# Altium schematic sheet [09]-USB,IMU,GNSS.SchDoc: S32K1_CONTROLLER
size A3; Date: 2/13/2019 7:04:58 PM; SheetNumber: 09; SheetTotal: 11; GateName_1: G$1; SymbolName_1: FRAME_B_L; LibraryName: frames; DeviceSetName: FRAME_B_L; GateName_2: G$2; SymbolName_2: DOCFIELD
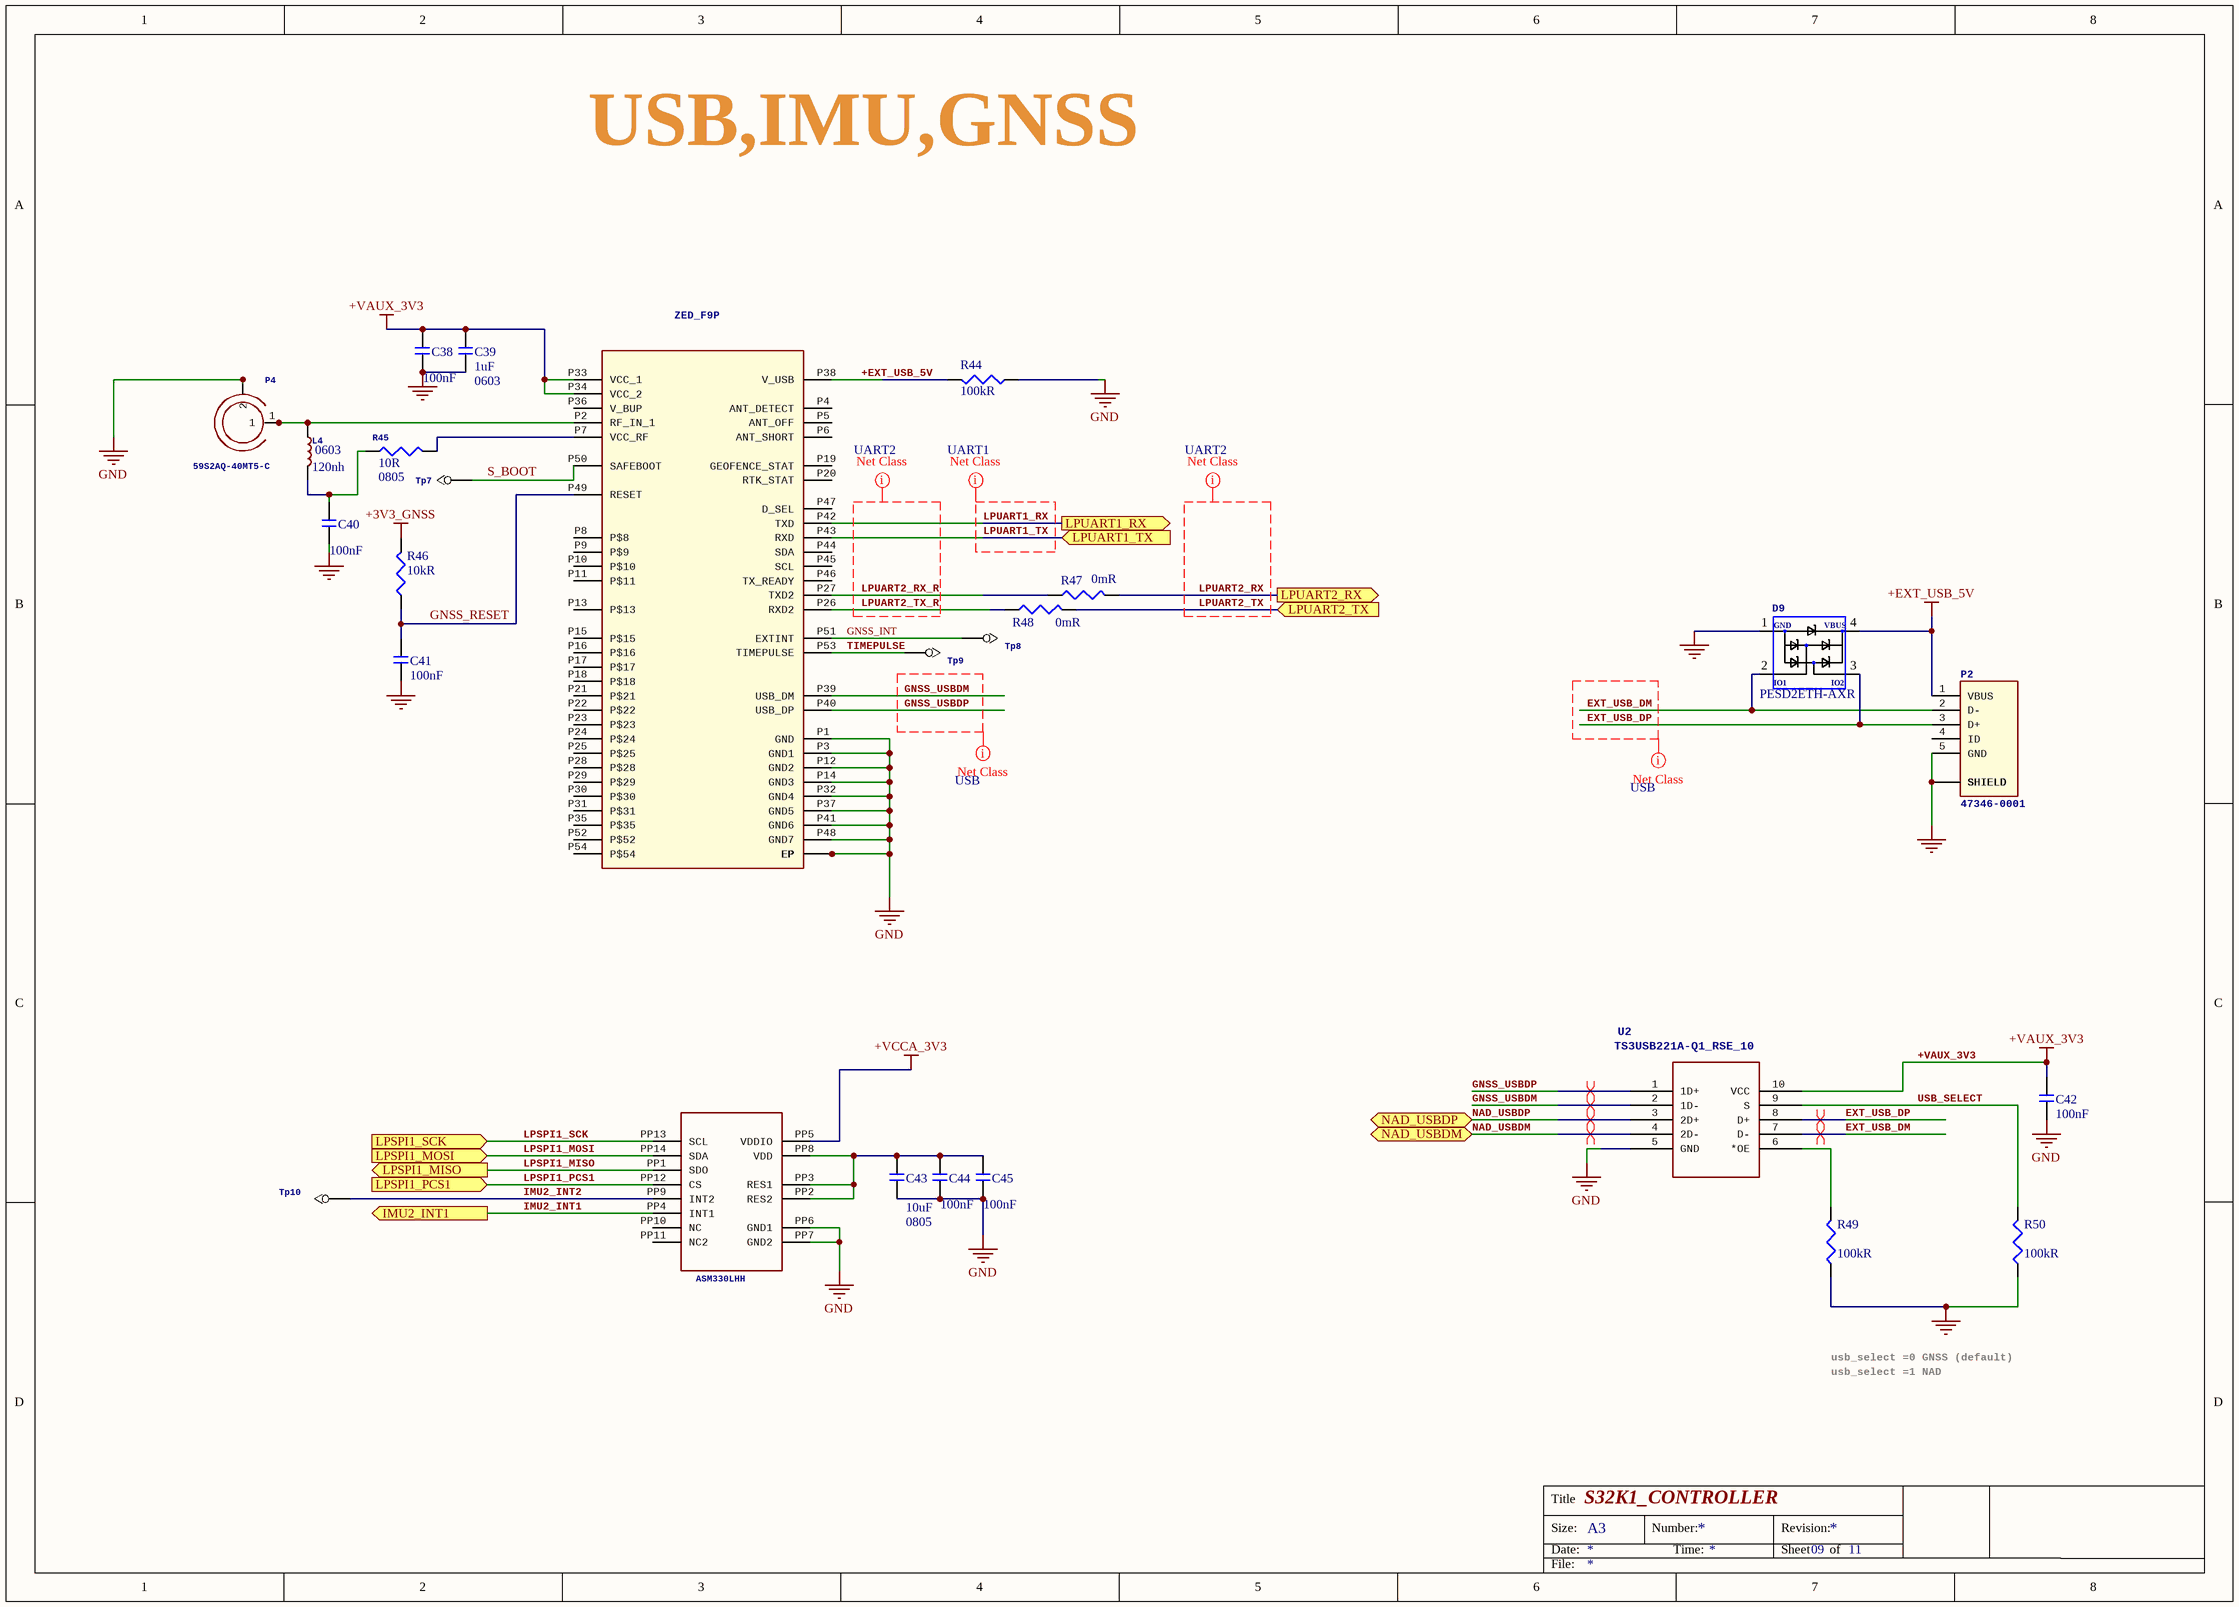
[diagram p0: [09]-USB,IMU,GNSS.SchDoc]

## Parts
C38  Capacitance: 100nF  [CAP0402]  (hidden comment: GCM155R71C104KA55D)
C39  Capacitance: 1uF  Case/Package: 0603  [CAP0603]  (hidden comment: CGA3E1X7R1C105K080AC)
C40  Capacitance: 100nF  [CAP0402]  (hidden comment: GCM155R71C104KA55D)
C41  Capacitance: 100nF  [CAP0402]  (hidden comment: GCM155R71C104KA55D)
C42  Capacitance: 100nF  [CAP0402]  (hidden comment: GCM155R71C104KA55D)
C43  Capacitance: 10uF  Case/Package: 0805  [CAP0805]  (hidden comment: CGA4J1X5R1C106K125AC)
C44  Capacitance: 100nF  [CAP0402]  (hidden comment: GCM155R71C104KA55D)
C45  Capacitance: 100nF  [CAP0402]  (hidden comment: GCM155R71C104KA55D)
D9  PESD2ETH-AXR  [WEON_SOT192P238X100-4N]
L4  Case/Package: 0603  Inductance: 120nh  [RES0603]  (hidden comment: LQW18ANR12J00D)
P2  47346-0001  [MOLEX_47346-0001]
P4  59S2AQ-40MT5-C  [59S2AQ-40MT5-C]
R44  Resistance: 100kR  [RES0402]  (hidden comment: ERJ-2GEJ104X)
R45  Resistance: 10R  Case Code (Imperial): 0805  [RES0805]  (hidden comment: ERJ-6ENF10R0V)
R46  Resistance: 10kR  [RES0402]  (hidden comment: ERJ-2GEJ103X)
R47  Resistance: 0mR  [RES0402]  (hidden comment: ERJ-2GE0R00X)
R48  Resistance: 0mR  [RES0402]  (hidden comment: ERJ-2GE0R00X)
R49  Resistance: 100kR  [RES0402]  (hidden comment: ERJ-2GEJ104X)
R50  Resistance: 100kR  [RES0402]  (hidden comment: ERJ-2GEJ104X)
ST  ASM330LHH  [LGA2.5X3]
Tp7  TP  [TestPoint]  (value not drawn)
Tp8  TP  [TestPoint]  (value not drawn)
Tp9  TP  [TestPoint]  (value not drawn)
Tp10  TP  [TestPoint]  (value not drawn)
U2  TS3USB221A-Q1_RSE_10  [WEONREFERENCEPLATFORM_RSE10]
U$7  GPS_UBLOX_ZED_F9P  [WEONREFERENCEBOARD_GPS_ZED]  (value not drawn)

## Ports
IMU2_INT1 (out), LPSPI1_MISO (out), LPSPI1_MOSI (in), LPSPI1_PCS1 (in), LPSPI1_SCK (in), LPUART1_RX (out), LPUART1_TX (in), LPUART2_RX (out), LPUART2_TX (in), NAD_USBDM (bidir), NAD_USBDP (bidir)

## Nets
+3V3_GNSS: R46.2
+EXT_USB_5V: D9.4 P2.1(VBUS) R44.2 U$7.P38(V_USB)
+VAUX_3V3: C38.1 C39.1 C42.2 U2.10(VCC) U$7.P33(VCC_1) U$7.P34(VCC_2)
+VCCA_3V3: ST.PP5(VDDIO)
GND: C38.2 C39.2 C40.2 C41.1 C42.1 C43.2 C44.2 C45.2 D9.1 P2.5(GND) P2.SH1(SHIELD) P2.SH2(SHIELD) P2.SH3(SHIELD) P2.SH4(SHIELD) P2.SH5(SHIELD) P2.SH6(SHIELD) P4.2_3_4_5_6_7_8_9(2) P4.3 P4.4 P4.5 P4.6 P4.7 P4.8 R44.1 R49.1 R50.1 ST.PP6(GND1) ST.PP7(GND2) U2.5(GND) U$7.55(EP) U$7.55_56_57_58_59_60_61_62_63_64_65_66_67_68_69_70_71_72_73_74_75_76_77_78_79_80_81_82_83_84_85_86_87_88_89_90_91_92_93_94_95_96_97_98_99_100_101_102(EP) U$7.56(EP) U$7.57(EP) U$7.58(EP) U$7.59(EP) U$7.60(EP) U$7.61(EP) U$7.62(EP) U$7.63(EP) U$7.64(EP) U$7.65(EP) U$7.66(EP) U$7.67(EP) U$7.68(EP) U$7.69(EP) U$7.70(EP) U$7.71(EP) U$7.72(EP) U$7.73(EP) U$7.74(EP) U$7.75(EP) U$7.76(EP) U$7.77(EP) U$7.78(EP) U$7.79(EP) U$7.80(EP) U$7.81(EP) U$7.82(EP) U$7.83(EP) U$7.84(EP) U$7.85(EP) U$7.86(EP) U$7.87(EP) U$7.88(EP) U$7.89(EP) U$7.90(EP) U$7.91(EP) U$7.92(EP) U$7.93(EP) U$7.94(EP) U$7.95(EP) U$7.96(EP) U$7.97(EP) U$7.98(EP) U$7.99(EP) U$7.100(EP) U$7.101(EP) U$7.102(EP) U$7.P1(GND) U$7.P3(GND1) U$7.P12(GND2) U$7.P14(GND3) U$7.P32(GND4) U$7.P37(GND5) U$7.P41(GND6) U$7.P48(GND7)
EXT_USB_DM: D9.2 P2.2(D-) U2.7(D-)
EXT_USB_DP: D9.3 P2.3(D+) U2.8(D+)
GNSS_INT: Tp8.1 U$7.P51(EXTINT)
GNSS_RESET: C41.2 R46.1 U$7.P49(RESET)
GNSS_USBDM: U2.2(1D-) U$7.P39(USB_DM)
GNSS_USBDP: U2.1(1D+) U$7.P40(USB_DP)
IMU2_INT1: ST.PP4(INT1) ; port IMU2_INT1
IMU2_INT2: ST.PP9(INT2) Tp10.1
LPSPI1_MISO: ST.PP1(SDO) ; port LPSPI1_MISO
LPSPI1_MOSI: ST.PP14(SDA) ; port LPSPI1_MOSI
LPSPI1_PCS1: ST.PP12(CS) ; port LPSPI1_PCS1
LPSPI1_SCK: ST.PP13(SCL) ; port LPSPI1_SCK
LPUART1_RX: U$7.P42(TXD) ; port LPUART1_RX
LPUART1_TX: U$7.P43(RXD) ; port LPUART1_TX
LPUART2_RX: R47.2 ; port LPUART2_RX
LPUART2_RX_R: R47.1 U$7.P27(TXD2)
LPUART2_TX: R48.2 ; port LPUART2_TX
LPUART2_TX_R: R48.1 U$7.P26(RXD2)
NAD_USBDM: U2.4(2D-) ; port NAD_USBDM
NAD_USBDP: U2.3(2D+) ; port NAD_USBDP
S_BOOT: Tp7.1 U$7.P50(SAFEBOOT)
TIMEPULSE: Tp9.1 U$7.P53(TIMEPULSE)
USB_SELECT: R50.2 U2.9(S)
NetC40_1: C40.1 L4.2 R45.1
NetC43_1: C43.1 C44.1 C45.1 ST.PP2(RES2) ST.PP3(RES1) ST.PP8(VDD)
NetL4_1: L4.1 P4.1 U$7.P2(RF_IN_1)
NetR45_2: R45.2 U$7.P7(VCC_RF)
NetR49_2: R49.2 U2.6(*OE)

Not connected (* = marked no-connect by the designer): P2 4(ID); ST PP10(NC) PP11(NC2); U$7 P4(ANT_DETECT) P5(ANT_OFF) P6(ANT_SHORT) P8(P$8) P9(P$9) P10(P$10) P11(P$11) P13(P$13) P15(P$15) P16(P$16) P17(P$17) P18(P$18) P19(GEOFENCE_STAT) P20(RTK_STAT) P21(P$21) P22(P$22) P23(P$23) P24(P$24) P25(P$25) P28(P$28) P29(P$29) P30(P$30) P31(P$31) P35(P$35) P36(V_BUP) P44(SDA) P45(SCL) P46(TX_READY) P47(D_SEL) P52(P$52) P54(P$54)

## Layout directives
differential pair: EXT_USB_DM, EXT_USB_DP, GNSS_USBDM, GNSS_USBDP, NAD_USBDM, NAD_USBDP
net class UART1: LPUART1_RX, LPUART1_TX
net class UART2: LPUART2_RX, LPUART2_RX_R, LPUART2_TX, LPUART2_TX_R
net class USB: EXT_USB_DM, EXT_USB_DP, GNSS_USBDM, GNSS_USBDP

## Notes on the sheet
- USB,IMU,GNSS
- usb_select =0 GNSS (default)
- usb_select =1 NAD
- Title
- Size:
- Date:
- A3
- Number:
- Time:
- Revision:
- Sheet
- of
- File:
- (in symbol PESD2ETH-AXR) GND; VBUS; IO1; IO2

## Library data of the parts
C38 C40-C42 C44 C45 = GCM155R71C104KA55D: Multilayer Ceramic Capacitors (MLCC) - SMD/SMT 0402 0.1uF 16volts X7R 10%; Manufacturer: Murata; Voltage Rating: 16V; Supplier 1: Arrow; Manufacturer Part Number: GCM155R71C104KA55D; Stock 1: 10660000; Pricing 1: 10000 = 0.01910, 1 = 0.05560, 10 = 0.04750, 25 = 0.03370, 100 = 0.02190, 250 = 0.02080 (USD); Mount: Surface Mount; Case/Package: 0402; Case Code (Metric): 1005; Case Code (Imperial): 0402; Min Operating Temperature: -55°C; Max Operating Temperature: 125°C; Package Quantity: 1; Tolerance: 10%; Packaging: Tape and Reel; Dielectric: X7R; Voltage Rating (DC): 16V; Termination: SMD/SMT; Voltage: 16V; Length: 1mm; Height: 0.5mm; Width: 0.02inch; Thickness: 0.022inch; Depth: 0.5mm; Ratings: AEC-Q200; Radiation Hardening: No; REACH SVHC: No SVHC; Lead Free: Lead Free; ComponentLink1URL: http://psearch.en.murata.com/capacitor/product/GCM155R71C104KA55%23.pdf?src-supplier=Avnet; ComponentLink1Description: http://psearch.en.murata.com/capacitor/product/GCM155R71C104KA55%23.pdf?src-supplier=Avnet; ComponentLink2URL: http://search.murata.co.jp/Ceramy/image/img/A01X/partnumbering_e_02.pdf?src-supplier=Digi-Key; ComponentLink2Description: http://search.murata.co.jp/Ceramy/image/img/A01X/partnumbering_e_02.pdf?src-supplier=Digi-Key; ComponentLink3URL: http://uk.rs-online.com/webdocs/1423/0900766b81423e06.pdf?src-supplier=RSComponents; ComponentLink3Description: http://uk.rs-online.com/webdocs/1423/0900766b81423e06.pdf?src-supplier=RSComponents; ComponentLink4URL: https://www.verical.com/server-webapp/html/getDatasheet?partID=220774&src-supplier=Verical; ComponentLink4Description: https://www.verical.com/server-webapp/html/getDatasheet?partID=220774&src-supplier=Verical; ComponentLink5URL: http://datasheet.octopart.com/GCM155R71C104KA55D-Murata-datasheet-11777063.pdf?src-supplier=_legacy+Avnet; ComponentLink5Description: http://datasheet.octopart.com/GCM155R71C104KA55D-Murata-datasheet-11777063.pdf?src-supplier=_legacy+Avnet; ComponentLink6URL: http://datasheet.octopart.com/GCM155R71C104KA55D-Murata-datasheet-14404342.pdf?src-supplier=Future+Electronics; ComponentLink6Description: http://datasheet.octopart.com/GCM155R71C104KA55D-Murata-datasheet-14404342.pdf?src-supplier=Future+Electronics; ComponentLink7URL: http://datasheet.octopart.com/GCM155R71C104KA55D-Murata-datasheet-12515163.pdf?src-supplier=Farnell; ComponentLink7Description: http://datasheet.octopart.com/GCM155R71C104KA55D-Murata-datasheet-12515163.pdf?src-supplier=Farnell; ComponentLink8URL: http://datasheet.octopart.com/GCM155R71C104KA55D-Murata-datasheet-44104237.pdf?src-supplier=Future+Electronics; ComponentLink8Description: http://datasheet.octopart.com/GCM155R71C104KA55D-Murata-datasheet-44104237.pdf?src-supplier=Future+Electronics; ComponentLink9URL: http://datasheet.octopart.com/GCM155R71C104KA55D-Murata-datasheet-62117434.pdf?src-supplier=TME; ComponentLink9Description: http://datasheet.octopart.com/GCM155R71C104KA55D-Murata-datasheet-62117434.pdf?src-supplier=TME; Supplier Part Number 1: GCM155R71C104KA55D
C39 = CGA3E1X7R1C105K080AC: CGA Series 0603 1 uF 16 V ±10 % Tolerance X7R SMT Multilayer Ceramic Capacitor; Manufacturer: TDK; Tolerance: 10%; Voltage Rating: 16V; Supplier 1: Digi-Key; Manufacturer Part Number: CGA3E1X7R1C105K080AC; Stock 1: 369291; Pricing 1: 1 = 0.15000, 10 = 0.10900, 100 = 0.05110, 500 = 0.03580, 1000 = 0.02963 (USD); Mount: Surface Mount; Weight: 7.1E-05oz; Case Code (Metric): 1608; Case Code (Imperial): 0603; Min Operating Temperature: -55°C; Max Operating Temperature: 125°C; Package Quantity: 4000; Packaging: Tape and Reel; Dielectric: X7R; Termination: SMD/SMT; Voltage Rating (DC): 16V; Length: 0.063inch; Height: 0.8mm; Width: 0.8mm; Thickness: 0.035inch; Ratings: AEC-Q200; REACH SVHC: No SVHC; Lead Free: Lead Free; ComponentLink1URL: http://datasheet.octopart.com/CGA3E1X7R1C105K080AC-TDK-datasheet-43366117.pdf?src-supplier=Newark; ComponentLink1Description: http://datasheet.octopart.com/CGA3E1X7R1C105K080AC-TDK-datasheet-43366117.pdf?src-supplier=Newark; ComponentLink2URL: http://datasheet.octopart.com/CGA3E1X7R1C105K080AC-TDK-datasheet-82475251.pdf?src-supplier=Newark; ComponentLink2Description: http://datasheet.octopart.com/CGA3E1X7R1C105K080AC-TDK-datasheet-82475251.pdf?src-supplier=Newark
C43 = CGA4J1X5R1C106K125AC: CGA Series 0805 10 uF 16 V ±10 % Tolerance X5R SMT Multilayer Ceramic Capacitor; Manufacturer: TDK; Tolerance: 10%; Voltage Rating: 16V; Supplier 1: Digi-Key; Manufacturer Part Number: CGA4J1X5R1C106K125AC; Stock 1: 128127; Pricing 1: 1 = 0.60000, 10 = 0.41400, 100 = 0.24840, 500 = 0.18630, 1000 = 0.15732 (USD); Mount: Surface Mount; Weight: 0.000194oz; Case Code (Metric): 2012; Case Code (Imperial): 0805; Min Operating Temperature: -55°C; Max Operating Temperature: 85°C; Package Quantity: 1; Packaging: Tape and Reel; Voltage Rating (DC): 16V; Dielectric: X5R; Termination: SMD/SMT; Composition: Ceramic; Length: 2mm; Height: 1.25mm; Width: 0.049inch; Thickness: 0.049inch; Depth: 1.25mm; Ratings: AEC-Q200; REACH SVHC: No SVHC; Lead Free: Lead Free; ComponentLink1URL: http://product.tdk.com/capacitor/mlcc/detailed_information.php?lang=en&amp;ref=jp&amp;part_no=CGA4J1X5R1C106K125AC&src-supplier=Mouser; ComponentLink1Description: http://product.tdk.com/capacitor/mlcc/detailed_information.php?lang=en&amp;ref=jp&amp;part_no=CGA4J1X5R1C106K125AC&src-supplier=Mouser; ComponentLink2URL: http://www.farnell.com/datasheets/1807242.pdf?src-supplier=Element14; ComponentLink2Description: http://www.farnell.com/datasheets/1807242.pdf?src-supplier=Element14; ComponentLink3URL: http://datasheet.octopart.com/CGA4J1X5R1C106K125AC-TDK-datasheet-12956201.pdf?src-supplier=Newark; ComponentLink3Description: http://datasheet.octopart.com/CGA4J1X5R1C106K125AC-TDK-datasheet-12956201.pdf?src-supplier=Newark; ComponentLink4URL: http://datasheet.octopart.com/CGA4J1X5R1C106K125AC-TDK-datasheet-13376850.pdf?src-supplier=Newark; ComponentLink4Description: http://datasheet.octopart.com/CGA4J1X5R1C106K125AC-TDK-datasheet-13376850.pdf?src-supplier=Newark; ComponentLink5URL: http://datasheet.octopart.com/CGA4J1X5R1C106K125AC-TDK-datasheet-33009218.pdf?src-supplier=Newark; ComponentLink5Description: http://datasheet.octopart.com/CGA4J1X5R1C106K125AC-TDK-datasheet-33009218.pdf?src-supplier=Newark; ComponentLink6URL: http://datasheet.octopart.com/CGA4J1X5R1C106K125AC-TDK-datasheet-32363556.pdf?src-supplier=Future+Electronics; ComponentLink6Description: http://datasheet.octopart.com/CGA4J1X5R1C106K125AC-TDK-datasheet-32363556.pdf?src-supplier=Future+Electronics; ComponentLink7URL: http://datasheet.octopart.com/CGA4J1X5R1C106K125AC-TDK-datasheet-26765558.pdf?src-supplier=Future+Electronics; ComponentLink7Description: http://datasheet.octopart.com/CGA4J1X5R1C106K125AC-TDK-datasheet-26765558.pdf?src-supplier=Future+Electronics; ComponentLink8URL: http://datasheet.octopart.com/CGA4J1X5R1C106K125AC-TDK-datasheet-43366117.pdf?src-supplier=Newark; ComponentLink8Description: http://datasheet.octopart.com/CGA4J1X5R1C106K125AC-TDK-datasheet-43366117.pdf?src-supplier=Newark; Supplier Part Number 1: 445-7883-1-ND
D9 = PESD2ETH-AXR: PESD2ETH-AX - Ultra low capacitance double rail-to-rail ESD protection diode; Manufacturer: NXP Semiconductors; Number of Bidirectional Channels: 2; Reverse Standoff Voltage: 5.5V; Min Breakdown Voltage: 6V; Power Line Protection: Yes; Supplier 1: Farnell; Stock 1: 3793; Pricing 1: 5 = 0.32200, 25 = 0.30700, 100 = 0.17200, 250 = 0.15300, 500 = 0.13300, 1000 = 0.11400, 5000 = 0.10200 (GBP); Mount: Surface Mount; Case/Package: TO-253-4; Min Operating Temperature: -40°C; Max Operating Temperature: 125°C; Packaging: Tape and Reel; ComponentLink1URL: http://datasheet.octopart.com/PESD2ETH-AXR-NXP-Semiconductors-datasheet-62110928.pdf?src-supplier=Farnell; ComponentLink1Description: http://datasheet.octopart.com/PESD2ETH-AXR-NXP-Semiconductors-datasheet-62110928.pdf?src-supplier=Farnell; ComponentLink2URL: http://datasheet.octopart.com/PESD2ETH-AXR-Nexperia-datasheet-87844174.pdf?src-supplier=Nexperia; ComponentLink2Description: http://datasheet.octopart.com/PESD2ETH-AXR-Nexperia-datasheet-87844174.pdf?src-supplier=Nexperia; Manufacturer Part Number: PESD2ETH-AXR
L4 = LQW18ANR12J00D: Inductor RF Chip Wirewound 120nH 5% 100MHz 32Q-Factor 180mA 1.3Ohm DCR 0603 Paper T/R; Manufacturer: Murata; Core Material: Non-Magnetic; Shielding: Unshielded; Q Factor: 32; Self Resonant Frequency: 1.6GHz; DC Resistance (DCR): 1.3R; Supplier 1: Arrow; Manufacturer Part Number: LQW18ANR12J00D; Stock 1: 10630; Pricing 1: 1 = 0.16150, 10 = 0.14620, 25 = 0.14460, 100 = 0.09550, 250 = 0.09450, 500 = 0.07770, 1000 = 0.06450, 3000 = 0.05480, 6000 = 0.04270 (USD); Mount: Surface Mount; Weight: 0.000106oz; Case Code (Metric): 1608; Case Code (Imperial): 0603; Min Operating Temperature: -55°C; Max Operating Temperature: 125°C; Package Quantity: 4000; Current Rating: 180mA; Tolerance: 5%; Packaging: Tape and Reel; Composition: Wirewound; Test Frequency: 100MHz; Max DC Current: 180mA; Termination: SMD/SMT; DC Current: 180mA; Military Standard: Not; Length: 1.6mm; Height: 0.8mm; Width: 0.031inch; Height - Seated (Max): 0.039inch; Depth: 1mm; Radiation Hardening: No; Lead Free: Lead Free; ComponentLink1URL: https://search.murata.co.jp/Ceramy/image/img/P02/JELF243A-0024.pdf?src-supplier=Digi-Key; ComponentLink1Description: https://search.murata.co.jp/Ceramy/image/img/P02/JELF243A-0024.pdf?src-supplier=Digi-Key; ComponentLink2URL: http://search.murata.co.jp/Ceramy/image/img/PDF/ENG/L0075S0080LQW18A_00.pdf?src-supplier=Avnet; ComponentLink2Description: http://search.murata.co.jp/Ceramy/image/img/PDF/ENG/L0075S0080LQW18A_00.pdf?src-supplier=Avnet; ComponentLink3URL: http://search.murata.co.jp/Ceramy/image/img/PDF/ENG/L0075S0080LQW18A_00.pdf?src-supplier=Future+Electronics; ComponentLink3Description: http://search.murata.co.jp/Ceramy/image/img/PDF/ENG/L0075S0080LQW18A_00.pdf?src-supplier=Future+Electronics; ComponentLink4URL: http://www.mouser.com/ds/2/281/murata_inductors-1115352.pdf?src-supplier=Mouser; ComponentLink4Description: http://www.mouser.com/ds/2/281/murata_inductors-1115352.pdf?src-supplier=Mouser; ComponentLink5URL: http://datasheet.octopart.com/LQW18ANR12J00D-Murata-datasheet-518094.pdf?src-supplier=Factory+Futures; ComponentLink5Description: http://datasheet.octopart.com/LQW18ANR12J00D-Murata-datasheet-518094.pdf?src-supplier=Factory+Futures; ComponentLink6URL: http://datasheet.octopart.com/LQW18ANR12J00D-Murata-datasheet-11553032.pdf?src-supplier=Factory+Futures; ComponentLink6Description: http://datasheet.octopart.com/LQW18ANR12J00D-Murata-datasheet-11553032.pdf?src-supplier=Factory+Futures; ComponentLink7URL: http://datasheet.octopart.com/LQW18ANR12J00D-Murata-datasheet-331.pdf?src-supplier=Digi-Key; ComponentLink7Description: http://datasheet.octopart.com/LQW18ANR12J00D-Murata-datasheet-331.pdf?src-supplier=Digi-Key; ComponentLink8URL: http://datasheet.octopart.com/LQW18ANR12J00D-Murata-datasheet-14066785.pdf?src-supplier=IIIC; ComponentLink8Description: http://datasheet.octopart.com/LQW18ANR12J00D-Murata-datasheet-14066785.pdf?src-supplier=IIIC; ComponentLink9URL: http://datasheet.octopart.com/LQW18ANR12J00D-Murata-datasheet-14392695.pdf; ComponentLink9Description: http://datasheet.octopart.com/LQW18ANR12J00D-Murata-datasheet-14392695.pdf; ComponentLink10URL: http://datasheet.octopart.com/LQW18ANR12J00D-Murata-datasheet-44661445.pdf?src-supplier=Future+Electronics; ComponentLink10Description: http://datasheet.octopart.com/LQW18ANR12J00D-Murata-datasheet-44661445.pdf?src-supplier=Future+Electronics; ComponentLink11URL: http://datasheet.octopart.com/LQW18ANR12J00D-Murata-datasheet-83054658.pdf?src-supplier=TME; ComponentLink11Description: http://datasheet.octopart.com/LQW18ANR12J00D-Murata-datasheet-83054658.pdf?src-supplier=TME
P2 = 47346-0001: CONN RCPT 5POS MICRO USB R/A  SMD; GateName_1: G$1; MF: Molex; SymbolName_1: 47346-0001; LibraryName: 47346-0001; DeviceSetName: 47346-0001; AVAILABILITY: Unavailable; MP: 47346-0001; PACKAGE: None; PRICE: None
P4 = 59S2AQ-40MT5-C: GateName_1: A; SymbolName_1: 59S2AQ-40MT5-C; LibraryName: WeOnReferencePlatform; DeviceSetName: 59S2AQ-40MT5-C
R44 R49 R50 = ERJ-2GEJ104X: Res Thick Film 0402 100K Ohm 5% 1/10W ±200ppm/°C Molded SMD SMD Punched Carrier T/R; Manufacturer: Panasonic; Power Rating: 100mW; Voltage Rating: 50V; Supplier 1: Arrow; Manufacturer Part Number: ERJ-2GEJ104X; Stock 1: 1680000; Pricing 1: 10000 = 0.00340, 30000 = 0.00280, 100000 = 0.00270, 1 = 0.00280, 100 = 0.00270, 500 = 0.00260, 6000 = 0.00250 (USD); Mount: Surface Mount; Case/Package: 0402; Case Code (Metric): 1005; Contact Plating: Tin; Min Operating Temperature: -55°C; Max Operating Temperature: 155°C; Tolerance: 5%; Packaging: Tape and Reel; Package Quantity: 1; Composition: Thick Film; Number of Terminations: 2; Temperature Coefficient: 200ppm/°C; Military Standard: Not; Termination: SMD/SMT; Max Power Dissipation: 100mW; Voltage Rating (DC): 50V; Features: Automotive AEC-Q200; Length: 1mm; Height: 0.35mm; Width: 0.02inch; Depth: 0.5mm; Radiation Hardening: No; REACH SVHC: No SVHC; Lead Free: Lead Free; ComponentLink1URL: http://www.farnell.com/datasheets/2059623.pdf?src-supplier=Farnell; ComponentLink1Description: http://www.farnell.com/datasheets/2059623.pdf?src-supplier=Farnell; ComponentLink2URL: http://www.jameco.com/Jameco/Products/ProdDS/1986799.pdf?src-supplier=Jameco; ComponentLink2Description: http://www.jameco.com/Jameco/Products/ProdDS/1986799.pdf?src-supplier=Jameco; ComponentLink3URL: http://www.mouser.com/ds/2/315/AOA0000C84-947596.pdf?src-supplier=Mouser; ComponentLink3Description: http://www.mouser.com/ds/2/315/AOA0000C84-947596.pdf?src-supplier=Mouser; ComponentLink4URL: https://www.alliedelec.com/m/d/51cd0790071e1666bdb9d00c57fcf960.pdf?src-supplier=Allied+Electronics; ComponentLink4Description: https://www.alliedelec.com/m/d/51cd0790071e1666bdb9d00c57fcf960.pdf?src-supplier=Allied+Electronics; ComponentLink5URL: http://industrial.panasonic.com/www-data/pdf/AOA0000/AOA0000CE1.pdf?src-supplier=Avnet; ComponentLink5Description: http://industrial.panasonic.com/www-data/pdf/AOA0000/AOA0000CE1.pdf?src-supplier=Avnet; ComponentLink6URL: http://www.farnell.com/datasheets/1500035.pdf?src-supplier=Element14; ComponentLink6Description: http://www.farnell.com/datasheets/1500035.pdf?src-supplier=Element14; ComponentLink7URL: http://datasheet.octopart.com/ERJ-2GEJ104X-Panasonic-datasheet-13266872.pdf?src-supplier=Newark; ComponentLink7Description: http://datasheet.octopart.com/ERJ-2GEJ104X-Panasonic-datasheet-13266872.pdf?src-supplier=Newark; ComponentLink8URL: http://datasheet.octopart.com/ERJ-2GEJ104X-Panasonic-datasheet-5314550.pdf?src-supplier=Jameco; ComponentLink8Description: http://datasheet.octopart.com/ERJ-2GEJ104X-Panasonic-datasheet-5314550.pdf?src-supplier=Jameco; ComponentLink9URL: http://datasheet.octopart.com/ERJ-2GEJ104X-Panasonic-datasheet-61114972.pdf?src-supplier=Newark; ComponentLink9Description: http://datasheet.octopart.com/ERJ-2GEJ104X-Panasonic-datasheet-61114972.pdf?src-supplier=Newark; ComponentLink10URL: http://datasheet.octopart.com/ERJ-2GEJ104X-Panasonic-datasheet-10554283.pdf?src-supplier=Newark; ComponentLink10Description: http://datasheet.octopart.com/ERJ-2GEJ104X-Panasonic-datasheet-10554283.pdf?src-supplier=Newark; ComponentLink11URL: http://datasheet.octopart.com/ERJ-2GEJ104X-Panasonic-datasheet-37173568.pdf?src-supplier=Electro+Sonic; ComponentLink11Description: http://datasheet.octopart.com/ERJ-2GEJ104X-Panasonic-datasheet-37173568.pdf?src-supplier=Electro+Sonic; ComponentLink12URL: http://datasheet.octopart.com/ERJ-2GEJ104X-Panasonic-datasheet-78375410.pdf; ComponentLink12Description: http://datasheet.octopart.com/ERJ-2GEJ104X-Panasonic-datasheet-78375410.pdf; ComponentLink13URL: http://datasheet.octopart.com/ERJ-2GEJ104X-Panasonic-datasheet-118655.pdf?src-supplier=Digi-Key; ComponentLink13Description: http://datasheet.octopart.com/ERJ-2GEJ104X-Panasonic-datasheet-118655.pdf?src-supplier=Digi-Key; ComponentLink14URL: http://datasheet.octopart.com/ERJ-2GEJ104X-Panasonic-datasheet-5313456.pdf?src-supplier=Farnell; ComponentLink14Description: http://datasheet.octopart.com/ERJ-2GEJ104X-Panasonic-datasheet-5313456.pdf?src-supplier=Farnell; ComponentLink15URL: http://datasheet.octopart.com/ERJ-2GEJ104X-Panasonic-datasheet-11480398.pdf?src-supplier=Arrow; ComponentLink15Description: http://datasheet.octopart.com/ERJ-2GEJ104X-Panasonic-datasheet-11480398.pdf?src-supplier=Arrow; ComponentLink16URL: http://datasheet.octopart.com/ERJ-2GEJ104X-Panasonic---ECG-datasheet-15994758.pdf?src-supplier=Farnell; ComponentLink16Description: http://datasheet.octopart.com/ERJ-2GEJ104X-Panasonic---ECG-datasheet-15994758.pdf?src-supplier=Farnell; ComponentLink17URL: http://datasheet.octopart.com/ERJ2GEJ104X-Panasonic-datasheet-27908757.pdf?src-supplier=Electro+Sonic; ComponentLink17Description: http://datasheet.octopart.com/ERJ2GEJ104X-Panasonic-datasheet-27908757.pdf?src-supplier=Electro+Sonic; ComponentLink18URL: http://datasheet.octopart.com/Thick-Film-Chip-Resistors-Panasonic-datasheet-family-105.pdf; ComponentLink18Description: http://datasheet.octopart.com/Thick-Film-Chip-Resistors-Panasonic-datasheet-family-105.pdf; Supplier Part Number 1: ERJ-2GEJ104X
R45 = ERJ-6ENF10R0V: Res Thick Film 0805 10 Ohm 1% 1/8W å±100ppm/å¡C Molded SMD SMD Punched Carrier; Manufacturer: Panasonic; Power Rating: 125mW; Voltage Rating: 150V; Temperature Coefficient: 100ppm/°C; Supplier 1: Digi-Key; Manufacturer Part Number: ERJ-6ENF10R0V; Stock 1: 143238; Pricing 1: 1 = 0.100000, 10 = 0.081000, 100 = 0.031100, 1000 = 0.013670, 2500 = 0.011810 (USD); Mount: Surface Mount; Case/Package: 0805; Number of Pins: 2; Case Code (Metric): 2012; Contact Plating: Tin; Min Operating Temperature: -55°C; Max Operating Temperature: 155°C; Tolerance: 1%; Packaging: Tape and Reel; Package Quantity: 1; Composition: Thick Film; Number of Terminations: 2; Termination: SMD/SMT; Military Standard: Not; Max Power Dissipation: 125mW; Voltage Rating (DC): 150V; Features: Automotive AEC-Q200; Length: 2mm; Height: 0.6mm; Width: 0.049inch; Depth: 1.25mm; Radiation Hardening: No; REACH SVHC: No SVHC; Lead Free: Lead Free; ComponentLink1URL: http://www.jameco.com/Jameco/Products/ProdDS/1989009.pdf?src-supplier=Jameco; ComponentLink1Description: http://www.jameco.com/Jameco/Products/ProdDS/1989009.pdf?src-supplier=Jameco; ComponentLink2URL: http://www.farnell.com/datasheets/1678782.pdf?src-supplier=Element14; ComponentLink2Description: http://www.farnell.com/datasheets/1678782.pdf?src-supplier=Element14; ComponentLink3URL: http://www.mouser.com/ds/2/315/AOA0000C283-1093288.pdf?src-supplier=Mouser; ComponentLink3Description: http://www.mouser.com/ds/2/315/AOA0000C283-1093288.pdf?src-supplier=Mouser; ComponentLink4URL: http://industrial.panasonic.com/www-data/pdf/AOA0000/AOA0000CE2.pdf?src-supplier=Avnet; ComponentLink4Description: http://industrial.panasonic.com/www-data/pdf/AOA0000/AOA0000CE2.pdf?src-supplier=Avnet; ComponentLink5URL: https://www.alliedelec.com/m/d/623f45ff1957d936ff56d46fd1c28cac.pdf?src-supplier=Allied+Electronics; ComponentLink5Description: https://www.alliedelec.com/m/d/623f45ff1957d936ff56d46fd1c28cac.pdf?src-supplier=Allied+Electronics; ComponentLink6URL: http://industrial.panasonic.com/www-data/pdf/AOA0000/AOA0000CE2.pdf?src-supplier=Future+Electronics; ComponentLink6Description: http://industrial.panasonic.com/www-data/pdf/AOA0000/AOA0000CE2.pdf?src-supplier=Future+Electronics; ComponentLink7URL: http://datasheet.octopart.com/ERJ-6ENF10R0V-Panasonic-datasheet-13266541.pdf?src-supplier=Allied+Electronics; ComponentLink7Description: http://datasheet.octopart.com/ERJ-6ENF10R0V-Panasonic-datasheet-13266541.pdf?src-supplier=Allied+Electronics; ComponentLink8URL: http://datasheet.octopart.com/ERJ-6ENF10R0V-Panasonic-datasheet-5313456.pdf?src-supplier=Future+Electronics; ComponentLink8Description: http://datasheet.octopart.com/ERJ-6ENF10R0V-Panasonic-datasheet-5313456.pdf?src-supplier=Future+Electronics; ComponentLink9URL: http://datasheet.octopart.com/ERJ-6ENF10R0V-Panasonic-datasheet-8853621.pdf?src-supplier=Future+Electronics; ComponentLink9Description: http://datasheet.octopart.com/ERJ-6ENF10R0V-Panasonic-datasheet-8853621.pdf?src-supplier=Future+Electronics; ComponentLink10URL: http://datasheet.octopart.com/ERJ-6ENF10R0V-Panasonic-datasheet-10025800.pdf?src-supplier=Future+Electronics; ComponentLink10Description: http://datasheet.octopart.com/ERJ-6ENF10R0V-Panasonic-datasheet-10025800.pdf?src-supplier=Future+Electronics; ComponentLink11URL: http://datasheet.octopart.com/ERJ-6ENF10R0V-Panasonic-datasheet-48891056.pdf?src-supplier=Newark; ComponentLink11Description: http://datasheet.octopart.com/ERJ-6ENF10R0V-Panasonic-datasheet-48891056.pdf?src-supplier=Newark; ComponentLink12URL: http://datasheet.octopart.com/ERJ-6ENF10R0V-Panasonic-datasheet-7538305.pdf?src-supplier=Jameco; ComponentLink12Description: http://datasheet.octopart.com/ERJ-6ENF10R0V-Panasonic-datasheet-7538305.pdf?src-supplier=Jameco; ComponentLink13URL: http://datasheet.octopart.com/ERJ-6ENF10R0V-Panasonic-datasheet-41391857.pdf?src-supplier=Electro+Sonic; ComponentLink13Description: http://datasheet.octopart.com/ERJ-6ENF10R0V-Panasonic-datasheet-41391857.pdf?src-supplier=Electro+Sonic; ComponentLink14URL: http://datasheet.octopart.com/ERJ-6ENF10R0V-Panasonic-datasheet-78375410.pdf; ComponentLink14Description: http://datasheet.octopart.com/ERJ-6ENF10R0V-Panasonic-datasheet-78375410.pdf; ComponentLink15URL: http://datasheet.octopart.com/ERJ-6ENF10R0V-Panasonic-datasheet-82288794.pdf?src-supplier=Future+Electronics; ComponentLink15Description: http://datasheet.octopart.com/ERJ-6ENF10R0V-Panasonic-datasheet-82288794.pdf?src-supplier=Future+Electronics; ComponentLink16URL: http://datasheet.octopart.com/ERJ-6ENF10R0V-Panasonic-datasheet-118621.pdf?src-supplier=Digi-Key; ComponentLink16Description: http://datasheet.octopart.com/ERJ-6ENF10R0V-Panasonic-datasheet-118621.pdf?src-supplier=Digi-Key
R46 = ERJ-2GEJ103X: Res Thick Film 0402 10K Ohm 5% 1/10W ±200ppm/°C Molded SMD SMD Punched Carrier T/R; Manufacturer: Panasonic; Power Rating: 100mW; Voltage Rating: 50V; Supplier 1: Digi-Key; Manufacturer Part Number: ERJ-2GEJ103X; Stock 1: 15334974; Pricing 1: 1 = 0.10000, 10 = 0.03100, 100 = 0.01250, 1000 = 0.00560, 2500 = 0.00486, 5000 = 0.00401 (USD); Mount: Surface Mount; Case/Package: 0402; Case Code (Metric): 1005; Case Code (Imperial): 0402; Contact Plating: Tin; Min Operating Temperature: -55°C; Max Operating Temperature: 155°C; Packaging: Cut Tape; Tolerance: 5%; Package Quantity: 1; Composition: Thick Film; Number of Terminations: 2; Termination: SMD/SMT; Military Standard: Not; Temperature Coefficient: 200ppm/°C; Max Power Dissipation: 100mW; Voltage Rating (DC): 50V; Features: Automotive AEC-Q200; Length: 1mm; Height: 0.35mm; Width: 0.02inch; Depth: 0.5mm; Radiation Hardening: No; REACH SVHC: No SVHC; Lead Free: Lead Free; ComponentLink1URL: http://industrial.panasonic.com/www-data/pdf/AOA0000/AOA0000CE1.pdf?src-supplier=Avnet+Europe; ComponentLink1Description: http://industrial.panasonic.com/www-data/pdf/AOA0000/AOA0000CE1.pdf?src-supplier=Avnet+Europe; ComponentLink2URL: http://www.farnell.com/datasheets/1678796.pdf?src-supplier=Element14; ComponentLink2Description: http://www.farnell.com/datasheets/1678796.pdf?src-supplier=Element14; ComponentLink3URL: http://www.mouser.com/ds/2/315/AOA0000CE1-37422.pdf?src-supplier=Mouser; ComponentLink3Description: http://www.mouser.com/ds/2/315/AOA0000CE1-37422.pdf?src-supplier=Mouser; ComponentLink4URL: http://www.farnell.com/datasheets/2059623.pdf?src-supplier=Farnell; ComponentLink4Description: http://www.farnell.com/datasheets/2059623.pdf?src-supplier=Farnell; ComponentLink5URL: https://www.alliedelec.com/m/d/51cd0790071e1666bdb9d00c57fcf960.pdf?src-supplier=Allied+Electronics; ComponentLink5Description: https://www.alliedelec.com/m/d/51cd0790071e1666bdb9d00c57fcf960.pdf?src-supplier=Allied+Electronics; ComponentLink6URL: http://www.jameco.com/Jameco/Products/ProdDS/1935721.pdf?src-supplier=Jameco; ComponentLink6Description: http://www.jameco.com/Jameco/Products/ProdDS/1935721.pdf?src-supplier=Jameco; ComponentLink7URL: http://industrial.panasonic.com/www-data/pdf/AOA0000/AOA0000CE1.pdf?src-supplier=Avnet; ComponentLink7Description: http://industrial.panasonic.com/www-data/pdf/AOA0000/AOA0000CE1.pdf?src-supplier=Avnet; ComponentLink8URL: http://datasheet.octopart.com/ERJ-2GEJ103X-Panasonic-datasheet-13266872.pdf?src-supplier=Newark; ComponentLink8Description: http://datasheet.octopart.com/ERJ-2GEJ103X-Panasonic-datasheet-13266872.pdf?src-supplier=Newark; ComponentLink9URL: http://datasheet.octopart.com/ERJ-2GEJ103X-Panasonic-datasheet-61114972.pdf?src-supplier=Farnell; ComponentLink9Description: http://datasheet.octopart.com/ERJ-2GEJ103X-Panasonic-datasheet-61114972.pdf?src-supplier=Farnell; ComponentLink10URL: http://datasheet.octopart.com/ERJ-2GEJ103X-Panasonic-datasheet-5314550.pdf?src-supplier=Element14; ComponentLink10Description: http://datasheet.octopart.com/ERJ-2GEJ103X-Panasonic-datasheet-5314550.pdf?src-supplier=Element14; ComponentLink11URL: http://datasheet.octopart.com/ERJ-2GEJ103X-Panasonic-datasheet-78375410.pdf; ComponentLink11Description: http://datasheet.octopart.com/ERJ-2GEJ103X-Panasonic-datasheet-78375410.pdf; ComponentLink12URL: http://datasheet.octopart.com/ERJ-2GEJ103X-Panasonic-datasheet-17720667.pdf?src-supplier=Jameco; ComponentLink12Description: http://datasheet.octopart.com/ERJ-2GEJ103X-Panasonic-datasheet-17720667.pdf?src-supplier=Jameco; ComponentLink13URL: http://datasheet.octopart.com/ERJ-2GEJ103X-Panasonic-datasheet-37173568.pdf?src-supplier=Electro+Sonic; ComponentLink13Description: http://datasheet.octopart.com/ERJ-2GEJ103X-Panasonic-datasheet-37173568.pdf?src-supplier=Electro+Sonic; ComponentLink14URL: http://datasheet.octopart.com/ERJ-2GEJ103X-Panasonic-datasheet-118598.pdf?src-supplier=Digi-Key; ComponentLink14Description: http://datasheet.octopart.com/ERJ-2GEJ103X-Panasonic-datasheet-118598.pdf?src-supplier=Digi-Key; ComponentLink15URL: http://datasheet.octopart.com/ERJ-2GEJ103X-Panasonic-datasheet-5313456.pdf?src-supplier=Farnell; ComponentLink15Description: http://datasheet.octopart.com/ERJ-2GEJ103X-Panasonic-datasheet-5313456.pdf?src-supplier=Farnell; ComponentLink16URL: http://datasheet.octopart.com/ERJ-2GEJ103X-Panasonic-datasheet-10554283.pdf?src-supplier=Farnell; ComponentLink16Description: http://datasheet.octopart.com/ERJ-2GEJ103X-Panasonic-datasheet-10554283.pdf?src-supplier=Farnell; ComponentLink17URL: http://datasheet.octopart.com/ERJ-2GEJ103X-Panasonic-datasheet-11480398.pdf?src-supplier=Arrow; ComponentLink17Description: http://datasheet.octopart.com/ERJ-2GEJ103X-Panasonic-datasheet-11480398.pdf?src-supplier=Arrow; ComponentLink18URL: http://datasheet.octopart.com/ERJ-2GEJ103X-Panasonic---ECG-datasheet-15994758.pdf?src-supplier=Farnell; ComponentLink18Description: http://datasheet.octopart.com/ERJ-2GEJ103X-Panasonic---ECG-datasheet-15994758.pdf?src-supplier=Farnell; ComponentLink19URL: http://datasheet.octopart.com/ERJ2GEJ103X-Panasonic-datasheet-27908757.pdf?src-supplier=Electro+Sonic; ComponentLink19Description: http://datasheet.octopart.com/ERJ2GEJ103X-Panasonic-datasheet-27908757.pdf?src-supplier=Electro+Sonic; ComponentLink20URL: http://datasheet.octopart.com/Thick-Film-Chip-Resistors-Panasonic-datasheet-family-105.pdf; ComponentLink20Description: http://datasheet.octopart.com/Thick-Film-Chip-Resistors-Panasonic-datasheet-family-105.pdf; Supplier Part Number 1: P10KJCT-ND
R47 R48 = ERJ-2GE0R00X: ERJ Series 0402 0 Ohm 0.1 W Jumper Surface Mount Thick Film Chip Resistor; Manufacturer: Panasonic; Power Rating: 100mW; Voltage Rating: 50V; Tolerance: 5%; Temperature Coefficient: 600ppm/°C; Supplier 1: Digi-Key; Manufacturer Part Number: ERJ-2GE0R00X; Stock 1: 56751052; Pricing 1: 1 = 0.10000, 10 = 0.03000, 25 = 0.02160, 50 = 0.01640, 100 = 0.01210, 250 = 0.00924, 500 = 0.00740, 1000 = 0.00545, 5000 = 0.00391 (USD); Mount: Surface Mount; Case/Package: 0402; Case Code (Metric): 1005; Case Code (Imperial): 0402; Contact Plating: Tin; Min Operating Temperature: -55°C; Max Operating Temperature: 155°C; Packaging: Tape and Reel; Package Quantity: 1; Composition: Thick Film; Number of Terminations: 2; Termination: SMD/SMT; Military Standard: Not; Max Power Dissipation: 100mW; Voltage Rating (DC): 50V; Features: Automotive AEC-Q200; Length: 1mm; Height: 0.35mm; Width: 0.02inch; Depth: 0.5mm; Radiation Hardening: No; REACH SVHC: No SVHC; Lead Free: Lead Free; ComponentLink1URL: http://industrial.panasonic.com/www-data/pdf/AOA0000/AOA0000CE1.pdf?src-supplier=Avnet; ComponentLink1Description: http://industrial.panasonic.com/www-data/pdf/AOA0000/AOA0000CE1.pdf?src-supplier=Avnet; ComponentLink2URL: http://www.alliedelec.com/m/d/51cd0790071e1666bdb9d00c57fcf960.pdf?src-supplier=Allied+Electronics; ComponentLink2Description: http://www.alliedelec.com/m/d/51cd0790071e1666bdb9d00c57fcf960.pdf?src-supplier=Allied+Electronics; ComponentLink3URL: http://industrial.panasonic.com/www-data/pdf/AOA0000/AOA0000CE1.pdf?src-supplier=Avnet+Europe; ComponentLink3Description: http://industrial.panasonic.com/www-data/pdf/AOA0000/AOA0000CE1.pdf?src-supplier=Avnet+Europe; ComponentLink4URL: http://www.farnell.com/datasheets/2059623.pdf?src-supplier=Farnell; ComponentLink4Description: http://www.farnell.com/datasheets/2059623.pdf?src-supplier=Farnell; ComponentLink5URL: http://www.farnell.com/datasheets/1678796.pdf?src-supplier=Element14; ComponentLink5Description: http://www.farnell.com/datasheets/1678796.pdf?src-supplier=Element14; ComponentLink6URL: http://www.farnell.com/datasheets/2059623.pdf?src-supplier=Element14; ComponentLink6Description: http://www.farnell.com/datasheets/2059623.pdf?src-supplier=Element14; ComponentLink7URL: http://datasheet.octopart.com/ERJ-2GE0R00X-Panasonic-datasheet-13266872.pdf?src-supplier=Newark; ComponentLink7Description: http://datasheet.octopart.com/ERJ-2GE0R00X-Panasonic-datasheet-13266872.pdf?src-supplier=Newark; ComponentLink8URL: http://datasheet.octopart.com/ERJ-2GE0R00X-Panasonic-datasheet-61114972.pdf?src-supplier=Newark; ComponentLink8Description: http://datasheet.octopart.com/ERJ-2GE0R00X-Panasonic-datasheet-61114972.pdf?src-supplier=Newark; ComponentLink9URL: http://datasheet.octopart.com/ERJ-2GE0R00X-Panasonic-datasheet-5314550.pdf?src-supplier=Future+Electronics; ComponentLink9Description: http://datasheet.octopart.com/ERJ-2GE0R00X-Panasonic-datasheet-5314550.pdf?src-supplier=Future+Electronics; ComponentLink10URL: http://datasheet.octopart.com/ERJ-2GE0R00X-Panasonic-datasheet-37173568.pdf?src-supplier=Electro+Sonic; ComponentLink10Description: http://datasheet.octopart.com/ERJ-2GE0R00X-Panasonic-datasheet-37173568.pdf?src-supplier=Electro+Sonic; ComponentLink11URL: http://datasheet.octopart.com/ERJ-2GE0R00X-Panasonic-datasheet-118655.pdf?src-supplier=Digi-Key; ComponentLink11Description: http://datasheet.octopart.com/ERJ-2GE0R00X-Panasonic-datasheet-118655.pdf?src-supplier=Digi-Key; ComponentLink12URL: http://datasheet.octopart.com/ERJ-2GE0R00X-Panasonic-datasheet-5313456.pdf?src-supplier=Farnell; ComponentLink12Description: http://datasheet.octopart.com/ERJ-2GE0R00X-Panasonic-datasheet-5313456.pdf?src-supplier=Farnell; ComponentLink13URL: http://datasheet.octopart.com/ERJ-2GE0R00X-Panasonic-datasheet-10554283.pdf?src-supplier=Farnell; ComponentLink13Description: http://datasheet.octopart.com/ERJ-2GE0R00X-Panasonic-datasheet-10554283.pdf?src-supplier=Farnell; ComponentLink14URL: http://datasheet.octopart.com/ERJ-2GE0R00X-Panasonic-datasheet-11480398.pdf?src-supplier=Arrow; ComponentLink14Description: http://datasheet.octopart.com/ERJ-2GE0R00X-Panasonic-datasheet-11480398.pdf?src-supplier=Arrow; ComponentLink15URL: http://datasheet.octopart.com/ERJ2GE0R00X-Panasonic-datasheet-27908757.pdf?src-supplier=Electro+Sonic; ComponentLink15Description: http://datasheet.octopart.com/ERJ2GE0R00X-Panasonic-datasheet-27908757.pdf?src-supplier=Electro+Sonic; Supplier Part Number 1: P0.0JCT-ND
ST = ASM330LHH: GateName_1: G$1; SymbolName_1: ASM330LHH; LibraryName: WeOn; DeviceSetName: ASM330LHH; ASM330LHH: ASM330LHH
Tp7-Tp10 = TP: GateName_1: G$1; TP?: >TP_NAME; SymbolName_1: TP; LibraryName: WeOnReferencePlatform; DeviceSetName: TP
U2 = TS3USB221A-Q1_RSE_10: GENERIC_PART_NUMBER: TS3USB221AQ1; MANUFACTURER: Texas Instruments; MANUFACTURER_PART_NUMBER: ts3usb221aq1_rse_10; GateName_1: A; FAMILY_NAME: USB SWITCH; INDUSTRY_STD_PKG_TYPE: UQFN; PACKAGE_DESIGNATOR: RSE; PIN_COUNT: 10; SymbolName_1: TS3USB221A-Q1_RSE_10; LibraryName: WeOnReferencePlatform; DeviceSetName: TS3USB221A-Q1_RSE_10; DATASHEETURL: httpwww.ti.comlitgpnTS3USB221AQ1; VENDOR: Texas Instruments
U$7 = GPS_UBLOX_ZED_F9P: GateName_1: G$1; SymbolName_1: GPS_F9P; LibraryName: WeOnReferenceBoard; DeviceSetName: GPS_UBLOX_ZED_F9P; ZED_F9P: ZED_F9P